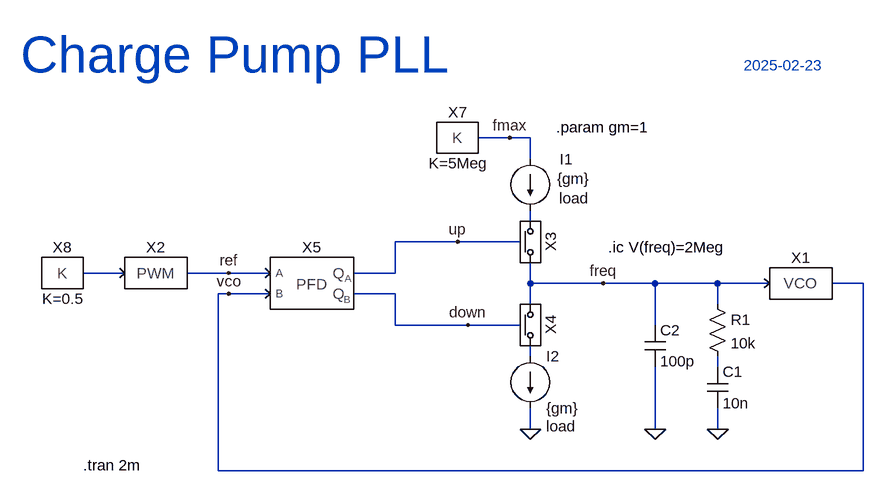
[diagram p0: schematic CP_PLL.asc]
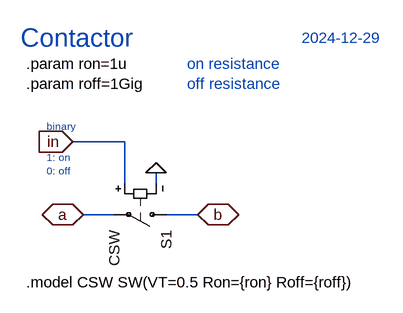
[diagram p1: sub-circuit contactor.asc]
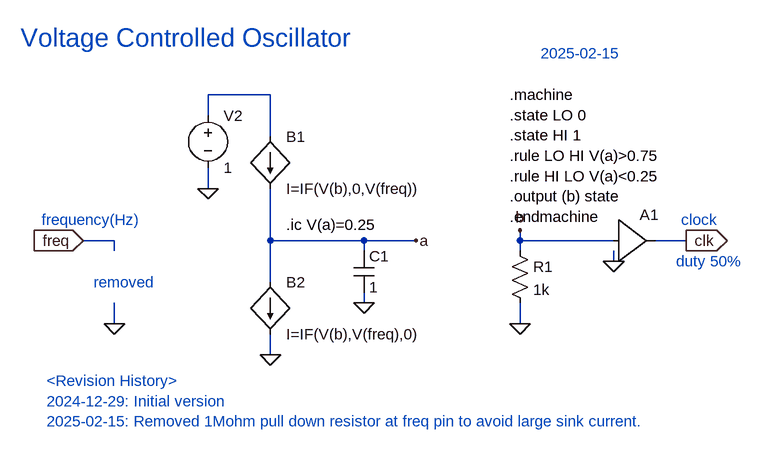
[diagram p2: sub-circuit vco.asc]
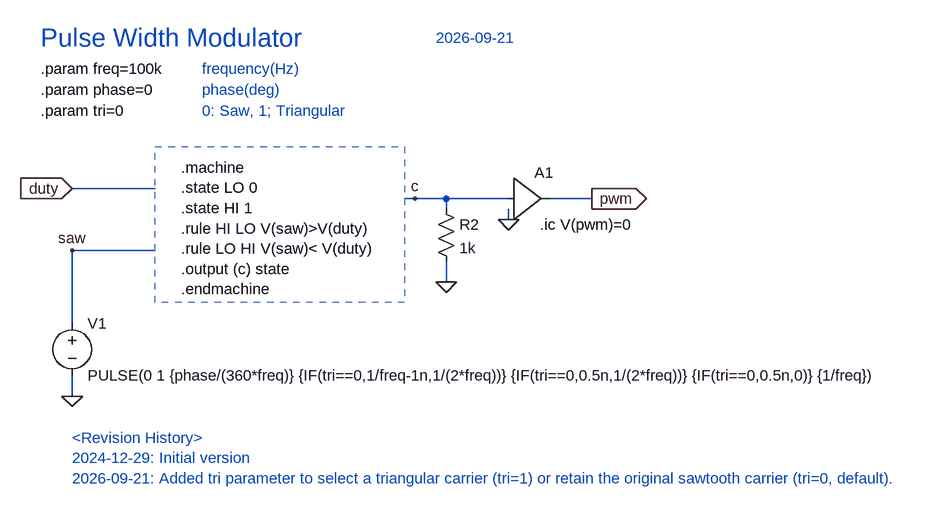
[diagram p3: sub-circuit pwm.asc]
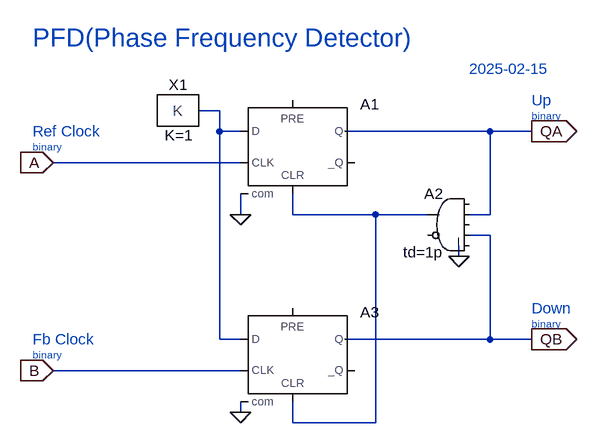
[diagram p4: sub-circuit pfd.asc]
CP_PLL.asc, the LTspice schematic file:
Version 4
SHEET 1 1968 1068
WIRE 800 80 752 80
WIRE 832 80 800 80
WIRE 832 112 832 80
WIRE 832 208 832 192
WIRE 720 240 624 240
WIRE 816 240 720 240
WIRE 208 288 144 288
WIRE 368 288 304 288
WIRE 432 288 368 288
WIRE 624 288 624 240
WIRE 624 288 560 288
WIRE 832 304 832 272
WIRE 944 304 832 304
WIRE 1024 304 944 304
WIRE 1120 304 1024 304
WIRE 1200 304 1120 304
WIRE 1344 304 1296 304
WIRE 368 320 352 320
WIRE 432 320 368 320
WIRE 624 320 560 320
WIRE 832 336 832 304
WIRE 1120 336 1120 304
WIRE 624 368 624 320
WIRE 736 368 624 368
WIRE 816 368 736 368
WIRE 1024 368 1024 304
WIRE 832 416 832 400
WIRE 1120 432 1120 416
WIRE 832 528 832 496
WIRE 1024 528 1024 432
WIRE 1120 528 1120 496
WIRE 352 592 352 320
WIRE 1344 592 1344 304
WIRE 1344 592 352 592
FLAG 1024 528 0
FLAG 832 528 0
FLAG 944 304 freq
FLAG 368 288 ref
FLAG 368 320 vco
FLAG 720 240 up
FLAG 736 368 down
FLAG 1120 528 0
FLAG 800 80 fmax
SYMBOL PowerSim\\CONTACTOR 816 240 R270
SYMATTR InstName X3
SYMBOL PowerSim\\CONTACTOR 816 368 R270
SYMATTR InstName X4
SYMBOL cap 1008 368 R0
SYMATTR InstName C2
SYMATTR Value 100p
SYMATTR SpiceLine Rser=1m
SYMBOL current 832 112 R0
WINDOW 123 0 0 Left 0
WINDOW 39 44 61 Left 2
WINDOW 0 45 1 Left 2
WINDOW 3 41 31 Left 2
SYMATTR SpiceLine load
SYMATTR InstName I1
SYMATTR Value {gm}
SYMBOL PowerSim\\VCO 1248 304 R0
SYMATTR InstName X1
SYMBOL current 832 416 R0
WINDOW 123 0 0 Left 0
WINDOW 39 24 108 Left 2
SYMATTR SpiceLine load
SYMATTR InstName I2
SYMATTR Value {gm}
SYMBOL PowerSim\\CONST 720 80 R0
WINDOW 39 1 55 Bottom 2
SYMATTR SpiceLine K=5Meg
SYMATTR InstName X7
SYMBOL PowerSim\\CONST 112 288 R0
WINDOW 39 1 55 Bottom 2
SYMATTR SpiceLine K=0.5
SYMATTR InstName X8
SYMBOL res 1104 320 R0
SYMATTR InstName R1
SYMATTR Value 10k
SYMBOL cap 1104 432 R0
SYMATTR InstName C1
SYMATTR Value 10n
SYMBOL PowerSim\\PWM 256 288 R0
SYMATTR InstName X2
SYMATTR SpiceLine freq=2Meg
SYMBOL PFD 496 304 R0
SYMATTR InstName X5
TEXT 48 -48 Left 6 ;Charge Pump PLL
TEXT 1160 -32 Left 2 ;2025-02-23
TEXT 144 584 Left 2 !.tran 2m
TEXT 952 248 Left 2 !.ic V(freq)=2Meg
TEXT 872 64 Left 2 !.param gm=1

contactor.asc, the sub-circuit schematic file:
Version 4
SHEET 1 1504 680
WIRE 416 128 336 128
WIRE 416 192 416 128
WIRE 464 192 464 176
WIRE 400 240 352 240
WIRE 528 240 480 240
FLAG 352 240 a
IOPIN 352 240 BiDir
FLAG 528 240 b
IOPIN 528 240 BiDir
FLAG 336 128 in
IOPIN 336 128 In
FLAG 464 176 0
SYMBOL sw 496 240 R90
SYMATTR InstName S1
SYMATTR Value CSW
SYMATTR Prefix SW
TEXT 264 8 Left 2 !.param ron=1u\n.param roff=1Gig
TEXT 264 344 Left 2 !.model CSW SW(VT=0.5 Ron={ron} Roff={roff})
TEXT 256 -32 Left 4 ;Contactor
TEXT 512 8 Left 2 ;on resistance\noff resistance
TEXT 296 104 Left 1 ;binary
TEXT 296 152 Left 1 ;1: on\n0: off
TEXT 688 -32 Left 2 ;2024-12-29

vco.asc, the sub-circuit schematic file:
Version 4
SHEET 1 1132 680
WIRE 176 -176 80 -176
WIRE 80 -144 80 -176
WIRE 176 -112 176 -176
WIRE 80 -32 80 -64
WIRE -64 48 -112 48
WIRE 176 48 176 -32
WIRE 320 48 176 48
WIRE 400 48 320 48
WIRE 560 48 560 32
WIRE 704 48 560 48
WIRE 816 48 768 48
WIRE -64 64 -64 48
WIRE 320 64 320 48
WIRE 560 64 560 48
WIRE 704 80 704 64
WIRE 176 112 176 48
WIRE 320 144 320 128
WIRE -64 176 -64 144
WIRE 560 176 560 144
WIRE 176 224 176 192
FLAG 320 144 0
FLAG 560 176 0
FLAG 176 224 0
FLAG 80 -32 0
FLAG 400 48 a
FLAG 560 32 b
FLAG 704 80 0
FLAG 816 48 clk
IOPIN 816 48 Out
FLAG -112 48 freq
IOPIN -112 48 In
FLAG -64 176 0
SYMBOL cap 304 64 R0
SYMATTR InstName C1
SYMATTR Value 1
SYMBOL res 544 48 R0
SYMATTR InstName R1
SYMATTR Value 1k
SYMBOL voltage 80 -160 R0
WINDOW 123 0 0 Left 0
WINDOW 39 0 0 Left 0
SYMATTR InstName V2
SYMATTR Value 1
SYMBOL bi 176 112 R0
SYMATTR InstName B2
SYMATTR Value I=IF(V(b),V(freq),0)
SYMBOL bi 176 -112 R0
SYMATTR InstName B1
SYMATTR Value I=IF(V(b),0,V(freq))
SYMBOL Digital\\buf1 704 -16 R0
SYMATTR InstName A1
TEXT 544 -176 Left 2 !.machine\n.state LO 0\n.state HI 1\n.rule LO HI V(a)>0.75\n.rule HI LO V(a)<0.25\n.output (b) state\n.endmachine
TEXT 200 24 Left 2 !.ic V(a)=0.25
TEXT -208 -264 Left 4 ;Voltage Controlled Oscillator
TEXT -176 16 Left 2 ;frequency(Hz)
TEXT 808 16 Left 2 ;clock
TEXT 800 80 Left 2 ;duty 50%
TEXT 592 -240 Left 2 ;2025-02-15
TEXT -168 264 Left 2 ;<Revision History>\n2024-12-29: Initial version\n2025-02-15: Removed 1Mohm pull down resistor at freq pin to avoid large sink current.
TEXT -96 112 Left 2 ;removed

pwm.asc, the sub-circuit schematic file:
Version 4.1
SHEET 1 1668 1312
WIRE 32 64 -96 64
WIRE 432 80 416 80
WIRE 480 80 432 80
WIRE 576 80 480 80
WIRE 704 80 640 80
WIRE 480 96 480 80
WIRE 576 112 576 96
WIRE 32 160 -96 160
WIRE 480 208 480 176
WIRE -96 272 -96 160
WIRE -96 384 -96 352
FLAG -96 64 duty
IOPIN -96 64 In
FLAG 704 80 pwm
IOPIN 704 80 Out
FLAG 480 208 0
FLAG 432 80 c
FLAG 576 112 0
FLAG -96 384 0
FLAG -96 160 saw
SYMBOL res 464 80 R0
SYMATTR InstName R2
SYMATTR Value 1k
SYMBOL Digital\\buf1 576 16 R0
SYMATTR InstName A1
SYMBOL voltage -96 256 R0
WINDOW 123 0 0 Left 0
WINDOW 39 0 0 Left 0
SYMATTR InstName V1
SYMATTR Value PULSE(0 1 {phase/(360*freq)} {IF(tri==0,1/freq-1n,1/(2*freq))} {IF(tri==0,0.5n,1/(2*freq))} {IF(tri==0,0.5n,0)} {1/freq})
TEXT 72 32 Left 2 !.machine\n.state LO 0\n.state HI 1\n.rule HI LO V(saw)>V(duty)\n.rule LO HI V(saw)< V(duty)\n.output (c) state\n.endmachine
TEXT -144 -120 Left 2 !.param freq=100k
TEXT 624 120 Left 2 !.ic V(pwm)=0
TEXT -144 -88 Left 2 !.param phase=0
TEXT -144 -168 Left 4 ;Pulse Width Modulator
TEXT 464 -168 Left 2 ;2026-09-21
TEXT 104 -120 Left 2 ;frequency(Hz)
TEXT -144 -56 Left 2 !.param tri=0
TEXT 104 -56 Left 2 ;0: Saw, 1; Triangular
TEXT 104 -88 Left 2 ;phase(deg)
TEXT -96 448 Left 2 ;<Revision History>\n2024-12-29: Initial version\n2026-09-21: Added tri parameter to select a triangular carrier (tri=1) or retain the original sawtooth carrier (tri=0, default).
RECTANGLE Normal 416 240 32 0 2

pfd.asc, the sub-circuit schematic file:
Version 4
SHEET 1 880 680
WIRE 192 112 160 112
WIRE 192 144 192 112
WIRE 224 144 192 144
WIRE 608 144 384 144
WIRE 672 144 608 144
WIRE 224 192 -64 192
WIRE 224 272 224 240
WIRE 304 272 304 240
WIRE 432 272 304 272
WIRE 512 272 432 272
WIRE 608 272 608 144
WIRE 608 272 576 272
WIRE 608 304 576 304
WIRE 560 336 560 320
WIRE 192 464 192 144
WIRE 224 464 192 464
WIRE 608 464 608 304
WIRE 608 464 384 464
WIRE 672 464 608 464
WIRE 224 512 -64 512
WIRE 224 576 224 560
WIRE 304 592 304 560
WIRE 432 592 432 272
WIRE 432 592 304 592
FLAG -64 192 A
IOPIN -64 192 In
FLAG -64 512 B
IOPIN -64 512 In
FLAG 224 272 0
FLAG 224 576 0
FLAG 560 336 0
FLAG 672 144 QA
IOPIN 672 144 Out
FLAG 672 464 QB
IOPIN 672 464 Out
SYMBOL Digital\\dflop 304 96 R0
SYMATTR InstName A1
SYMBOL Digital\\and 544 224 M0
WINDOW 3 8 106 Left 2
SYMATTR Value td=1p
SYMATTR InstName A2
SYMBOL Digital\\dflop 304 416 R0
SYMATTR InstName A3
SYMBOL PowerSim\\CONST 128 112 R0
WINDOW 39 1 54 Bottom 2
SYMATTR InstName X1
TEXT -96 0 Left 4 ;PFD(Phase Frequency Detector)
TEXT 576 48 Left 2 ;2025-02-15
TEXT -96 168 Left 1 ;binary
TEXT -96 488 Left 1 ;binary
TEXT -96 144 Left 2 ;Ref Clock
TEXT -96 464 Left 2 ;Fb Clock
TEXT 672 96 Left 2 ;Up
TEXT 672 416 Left 2 ;Down
TEXT 672 120 Left 1 ;binary
TEXT 672 440 Left 1 ;binary

The netlist it stands for:
* CP_PLL.asc
XX3 up freq N001 contactor params: ron=1u roff=1Gig
XX4 down N003 freq contactor params: ron=1u roff=1Gig
C2 freq 0 100p Rser=1m
I1 fmax N001 {gm} load
XX1 freq vco vco
I2 N003 0 {gm} load
XX7 fmax CONST K=5Meg  ; pins K
XX8 N002 CONST K=0.5  ; pins K
R1 freq N004 10k
C1 N004 0 10n
XX2 N002 ref pwm params: tri=0 freq=2Meg phase=0
XX5 ref vco up down pfd

* block symbol definitions
.subckt contactor in a b
S1 b a in 0 CSW
.param ron=1u
.param roff=1Gig
.model CSW SW(VT=0.5 Ron={ron} Roff={roff})
* Contactor
* on resistance
* off resistance
* binary
* 1: on
* 0: off
* 2024-12-29
.ends contactor

.subckt vco freq clk
C1 a 0 1
R1 b 0 1k
V2 N001 0 1
B2 a 0 I=IF(V(b),V(freq),0)
B1 N001 a I=IF(V(b),0,V(freq))
A1 b 0 0 0 0 0 clk 0 BUF
.machine
.state LO 0
.state HI 1
.rule LO HI V(a)>0.75
.rule HI LO V(a)<0.25
.output (b) state
.endmachine
.ic V(a)=0.25
* Voltage Controlled Oscillator
* frequency(Hz)
* clock
* duty 50%
* 2025-02-15
* <Revision History>
* 2024-12-29: Initial version
* 2025-02-15: Removed 1Mohm pull down resistor at freq pin to avoid large sink current.
* removed
.ends vco

.subckt pwm duty pwm
R2 c 0 1k
A1 c 0 0 0 0 0 pwm 0 BUF
V1 saw 0 PULSE(0 1 {phase/(360*freq)} {IF(tri==0,1/freq-1n,1/(2*freq))} {IF(tri==0,0.5n,1/(2*freq))} {IF(tri==0,0.5n,0)} {1/freq})
.machine
.state LO 0
.state HI 1
.rule HI LO V(saw)>V(duty)
.rule LO HI V(saw)< V(duty)
.output (c) state
.endmachine
.param freq=100k
.ic V(pwm)=0
.param phase=0
* Pulse Width Modulator
* 2026-09-21
* frequency(Hz)
.param tri=0
* 0: Saw, 1; Triangular
* phase(deg)
* <Revision History>
* 2024-12-29: Initial version
* 2026-09-21: Added tri parameter to select a triangular carrier (tri=1) or retain the original sawtooth carrier (tri=0, default).
.ends pwm

.subckt pfd A B QA QB
A1 N001 0 A 0 N002 0 QA 0 DFLOP
A2 0 QA 0 QB 0 0 N002 0 AND td=1p
A3 N001 0 B 0 N002 0 QB 0 DFLOP
XX1 N001 CONST K=1  ; pins K
* PFD(Phase Frequency Detector)
* 2025-02-15
* binary
* binary
* Ref Clock
* Fb Clock
* Up
* Down
* binary
* binary
.ends pfd

* Charge Pump PLL
* 2025-02-23
.tran 2m
.ic V(freq)=2Meg
.param gm=1
.backanno
.end